# Altium schematic sheet STM32 MCU.SchDoc: C-F-U-Bridge
size A3; ApprovedBy: Luca Schenetti; CheckedBy: Luca Schenetti; Author: Luca Schenetti; DrawnBy: Luca Schenetti; Engineer: Luca Schenetti; Revision: A; SheetNumber: 7; SheetTotal: 7
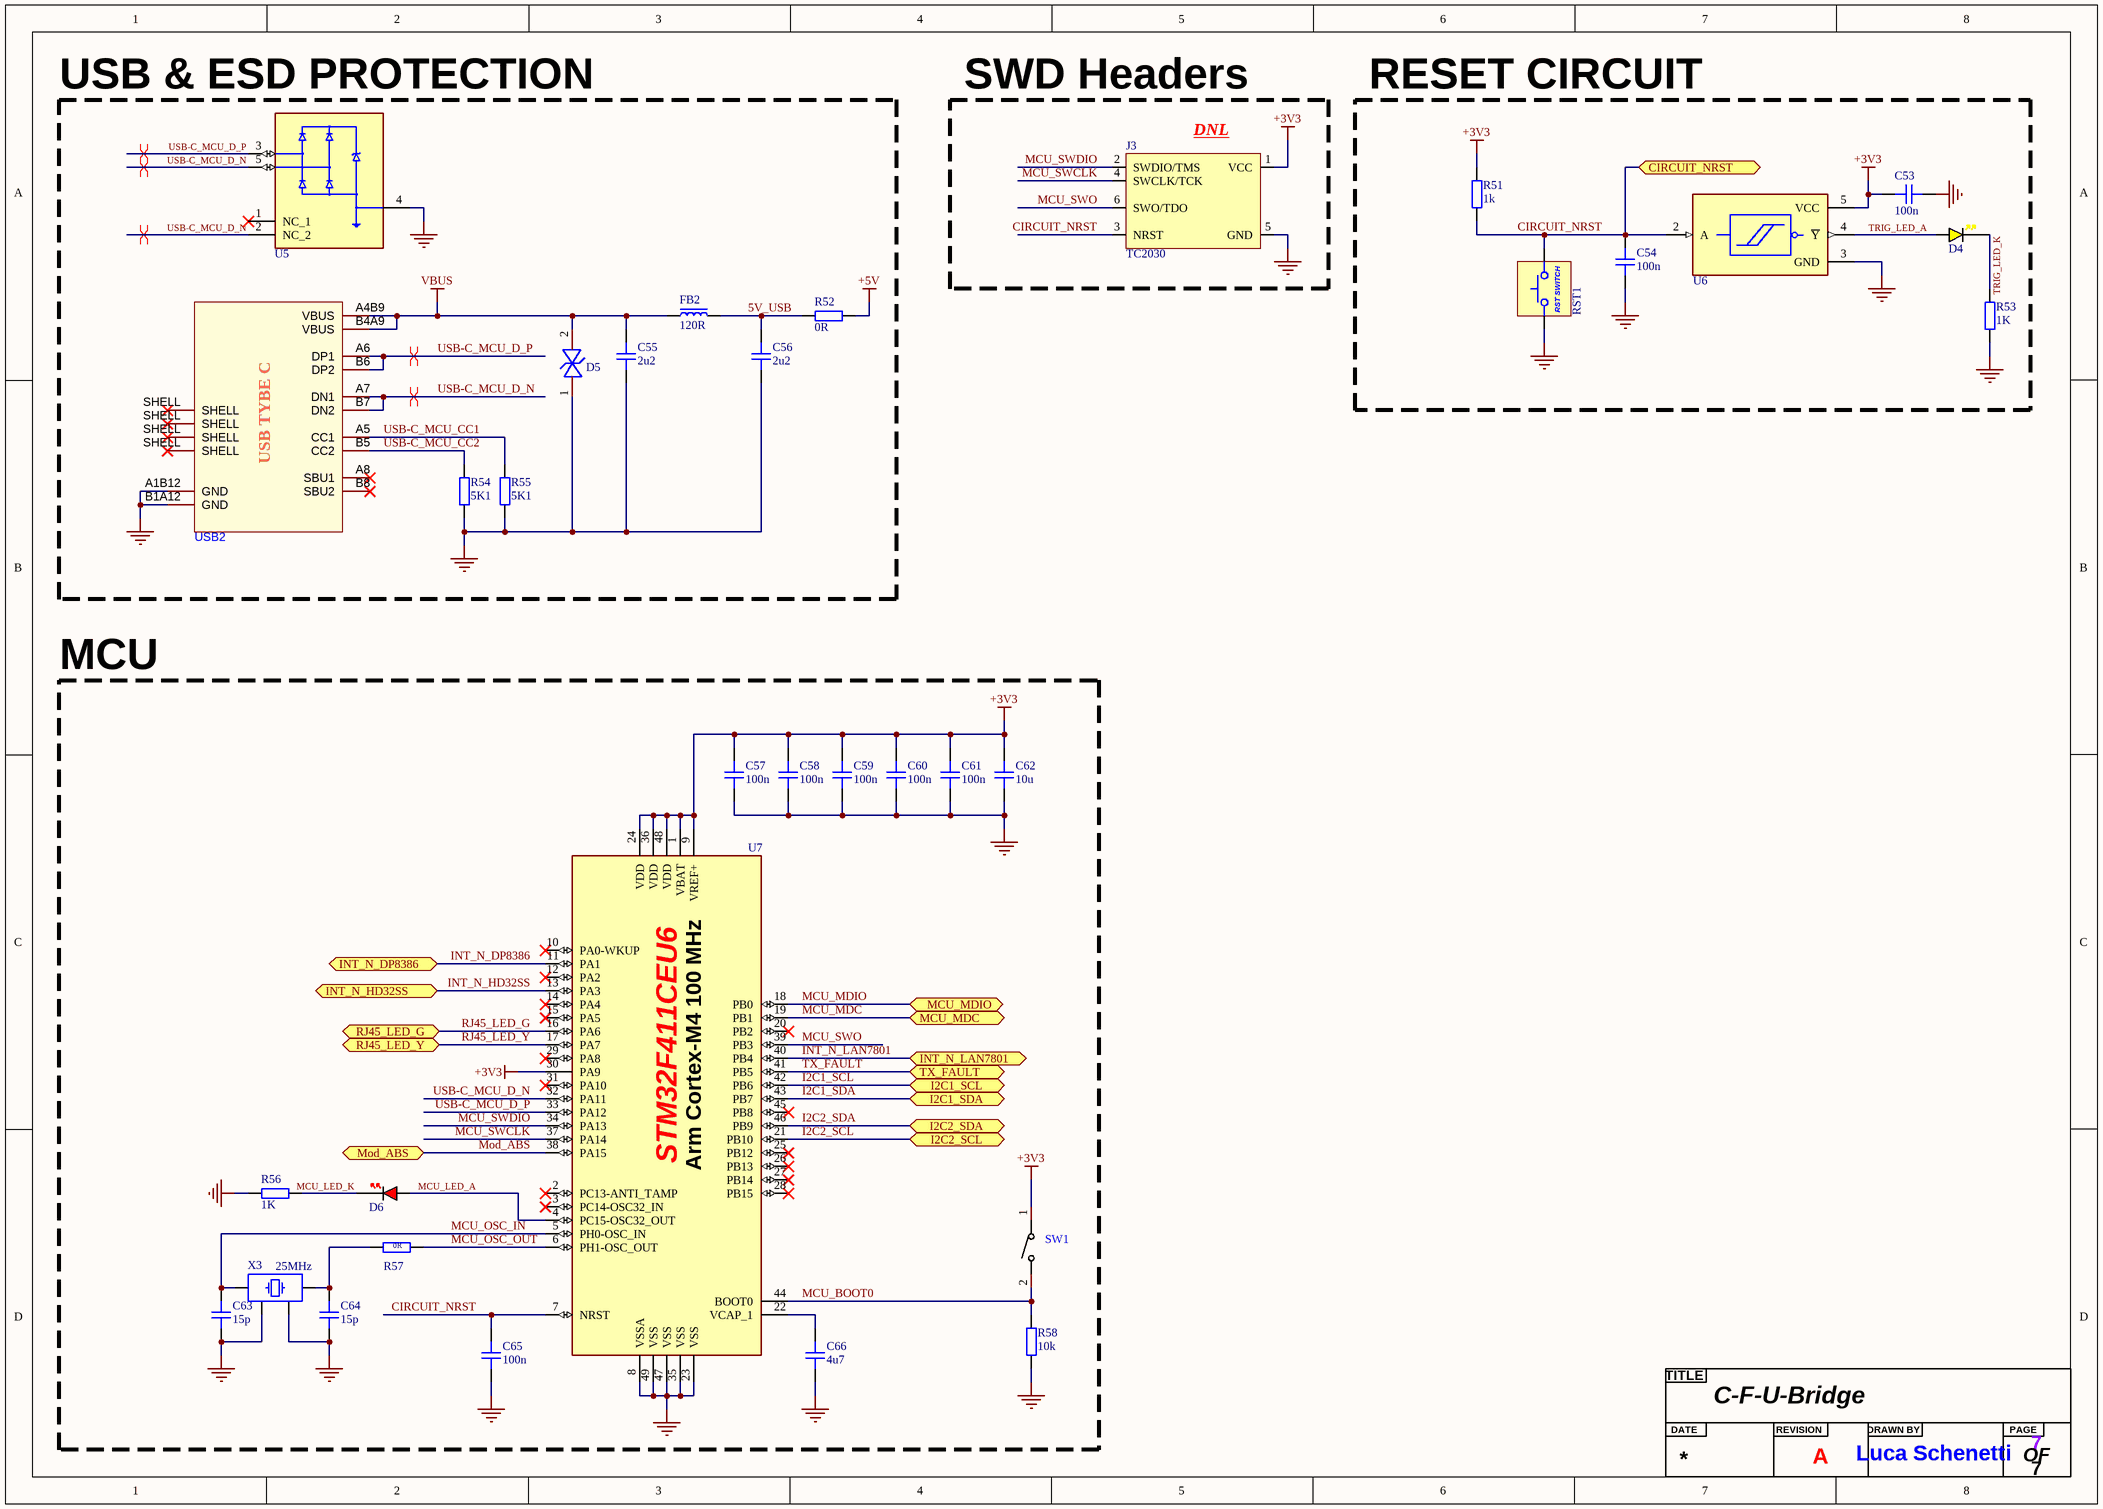
[diagram p0: STM32 MCU.SchDoc]

## Parts
?  Title  (value not drawn)  (graphical)
C53  100n  [CAP_0402]
C54  100n  [CAP_0402]
C55  2u2  [CAP_0603]
C56  2u2  [CAP_0603]
C57  100n  [CAP_0603]
C58  100n  [CAP_0603]
C59  100n  [CAP_0603]
C60  100n  [CAP_0603]
C61  100n  [CAP_0603]
C62  10u  [CAP_0603]
C63  15p  [CAP_0402]
C64  15p  [CAP_0402]
C65  100n  [CAP_0603]
C66  4u7  [CAP_0603]
D4  YELLOW  [LED_0603_YELLOW]  (value not drawn)
D5  ESD Protection TVS 6.0V  [SMF6.0CA]  (value not drawn)
D6  RED  [LED_0603_RED]  (value not drawn)
FB2  120R  [FB_0603]
J3  TC2030  [TC2030-FP]  (no BOM)
R51  1k  [RES_0402]
R52  0R  [RES_0603]
R53  1K  [RES_0402]
R54  5K1  [RES_0603]
R55  5K1  [RES_0603]
R56  1K  [RES_0402]
R57  0R  [RES_0402]
R58  10k  [RES_0603]
RST1  RST_SWITCH_STM32  [RST_SWITCH]  (value not drawn)
SW1  TS-1088-AR02016  [TS-1088-AR02016]  (value not drawn)
U5  TVS USB 2.0 ±25-kV  [TPD2E2U06DRLR]  (value not drawn)
U6  Schmitt Trigger 1.65V~5.5V  [74LVC1G14GW,125]  (value not drawn)
U7  ARM® Cortex®-M4 STM32F4  [STM32F411CEU6]  (value not drawn)
USB2  USB-C CONNECTOR  [USB-3.1-SMD_U262-161N-4BVC11]  (value not drawn)
X3  25MHz  [XTAL_3225]

## Blocks framed on the sheet
USB & ESD PROTECTION: C55 C56 D5 FB2 R52 R54 R55 U5 USB2
SWD Headers: J3
RESET CIRCUIT: C53 C54 D4 R51 R53 RST1 U6
MCU: C57-C66 D6 R56-R58 SW1 U7 X3

## Ports
CIRCUIT_NRST (bidir, see PHY SFC[2C], RGMII USB[3D]), I2C1_SCL (bidir, see PHY SFC CONN[4B]), I2C1_SDA (bidir, see PHY SFC CONN[4B]), I2C2_SCL (bidir, see USB RGMII CONN[1B]), I2C2_SDA (bidir, see USB RGMII CONN[1B]), INT_N_DP8386 (bidir, see PHY SFC[2B]), INT_N_HD32SS (bidir, see USB RGMII CONN[2B]), INT_N_LAN7801 (bidir, see RGMII USB[6C]), MCU_MDC (bidir, see PHY SFC[2B]), MCU_MDIO (bidir, see PHY SFC[2B]), Mod_ABS (bidir, see PHY SFC CONN[4B]), RJ45_LED_G (bidir, see PHY SFC CONN[4C]), RJ45_LED_Y (bidir, see PHY SFC CONN[4C]), TX_FAULT (bidir, see PHY SFC CONN[4A])

## Nets
+3V3: C53.2 C57.2 C58.2 C59.2 C60.2 C61.2 C62.2 J3.1(VCC) R51.2 SW1.1 U6.5(VCC) U7.1(VBAT) U7.9(VREF+) U7.24(VDD) U7.30(PA9) U7.36(VDD) U7.48(VDD)
+5V: R52.2
GND: C53.1 C54.1 C55.1 C56.1 C57.1 C58.1 C59.1 C60.1 C61.1 C62.1 C63.1 C64.1 C65.1 C66.1 D5.1(C) J3.5(GND) R53.1 R54.1 R55.1 R56.1 R58.1 RST1.1 U5.4(GND) U6.3(GND) U7.8(VSSA) U7.23(VSS) U7.35(VSS) U7.47(VSS) U7.49(VSS) USB2.A1B12(GND) USB2.B1A12(GND) X3.2 X3.4
VBUS: C55.2 D5.2(A) FB2.1 USB2.A4B9(VBUS) USB2.B4A9(VBUS)
5V_USB: C56.2 FB2.2 R52.1
CIRCUIT_NRST: C54.2 C65.2 J3.3(NRST) R51.1 RST1.2 U6.2(A) U7.7(NRST) ; port CIRCUIT_NRST
I2C1_SCL: U7.42(PB6) ; port I2C1_SCL
I2C1_SDA: U7.43(PB7) ; port I2C1_SDA
I2C2_SCL: U7.21(PB10) ; port I2C2_SCL
I2C2_SDA: U7.46(PB9) ; port I2C2_SDA
INT_N_DP8386: U7.11(PA1) ; port INT_N_DP8386
INT_N_HD32SS: U7.13(PA3) ; port INT_N_HD32SS
INT_N_LAN7801: U7.40(PB4) ; port INT_N_LAN7801
MCU_BOOT0: R58.2 SW1.2 U7.44(BOOT0)
MCU_LED_A: D6.A U7.4(PC15-OSC32_OUT)
MCU_LED_K: D6.K R56.2
MCU_MDC: U7.19(PB1) ; port MCU_MDC
MCU_MDIO: U7.18(PB0) ; port MCU_MDIO
MCU_OSC_IN: C63.2 U7.5(PH0-OSC_IN) X3.3
MCU_OSC_OUT: R57.2 U7.6(PH1-OSC_OUT)
MCU_SWCLK: J3.4(SWCLK/TCK) U7.37(PA14)
MCU_SWDIO: J3.2(SWDIO/TMS) U7.34(PA13)
MCU_SWO: J3.6(SWO/TDO) U7.39(PB3)
Mod_ABS: U7.38(PA15) ; port Mod_ABS
RJ45_LED_G: U7.16(PA6) ; port RJ45_LED_G
RJ45_LED_Y: U7.17(PA7) ; port RJ45_LED_Y
TRIG_LED_A: D4.A U6.4(~{Y})
TRIG_LED_K: D4.K R53.2
TX_FAULT: U7.41(PB5) ; port TX_FAULT
USB-C_MCU_CC1: R55.2 USB2.A5(CC1)
USB-C_MCU_CC2: R54.2 USB2.B5(CC2)
USB-C_MCU_D_N: U5.2(NC_2) U5.5(IO2) U7.32(PA11) USB2.A7(DN1) USB2.B7(DN2)
USB-C_MCU_D_P: U5.3(IO1) U7.33(PA12) USB2.A6(DP1) USB2.B6(DP2)
NetC64_2: C64.2 R57.1 X3.1
NetC66_2: C66.2 U7.22(VCAP_1)

Not connected (* = marked no-connect by the designer): U5 1(NC_1)*; U7 2(PC13-ANTI_TAMP)* 3(PC14-OSC32_IN)* 10(PA0-WKUP)* 12(PA2)* 14(PA4)* 15(PA5)* 20(PB2)* 25(PB12)* 26(PB13)* 27(PB14)* 28(PB15)* 29(PA8)* 31(PA10)* 45(PB8)*; USB2 A8(SBU1)* B8(SBU2)* SHELL*

## Layout directives
differential pair; differential pair class DIFF_USB_90Ω: USB-C_MCU_D_N, USB-C_MCU_D_P

## Notes on the sheet
- (near J3) DNL
- (in symbol RST_SWITCH) RST SWITCH
- (in symbol STM32F411CEU6) Arm Cortex-M4 100 MHz
- (in symbol Title) TITLE; DATE; REVISION; DRAWN BY; PAGE; OF
- (in symbol U262-161N-4BVC11) USB TYBE C

## Library data of the parts
C53 C54 = CAP_0402: Capacitor SMD 0402 [C1525]; Manufacturer: *; Manufacturer Part Number: *; Distributor Link: *; LCSC: *; Rating: *; Dielectric: *
C55 C56 = CAP_0603: Capacitor SMD 0603 [C23630]; Manufacturer: *; Manufacturer Part Number: *; Distributor Link: *; LCSC: *; Rating: *; Dielectric: *
C57-C61 C65 = CAP_0603: Capacitor SMD 0603 [C14663]; Manufacturer: *; Manufacturer Part Number: *; Distributor Link: *; LCSC: *; Rating: *; Dielectric: *
C62 = CAP_0603: Capacitor SMD 0603 [C96446]; Manufacturer: *; Manufacturer Part Number: *; Distributor Link: *; LCSC: *; Rating: *; Dielectric: *
C63 C64 = CAP_0402: Capacitor SMD 0402 [C1548]; Manufacturer: *; Manufacturer Part Number: *; Distributor Link: *; LCSC: *; Rating: *; Dielectric: *
C66 = CAP_0603: Capacitor SMD 0603 [C19666]; Manufacturer: *; Manufacturer Part Number: *; Distributor Link: *; LCSC: *; Rating: *; Dielectric: *
D4 = LED_0603_YELLOW: LED 0603 YELLOW SMD[C72038]
D5 = SMF6.0CA: [C2990473]
D6 = LED_0603_RED: LED 0603 RED SMD[C2926776]
FB2 = FB_0603: Ferrite Bead SMD 0603[C76892]; Manufacturer: *; Manufacturer Part Number: *; Distributor Link: *; LCSC: *
J3 = TC2030: Tag-Connect No-Solder SWD Debug Connector DO NOT PLACE; Manufacturer: Tag-Connect; Manufacturer Part Number: TC2030
R51 R53 R56 = RES_0402: Resistor SMD 0402 [C11702]; Manufacturer: *; Manufacturer Part Number: *; Distributor Link: *; LCSC: *
R52 = RES_0603: [C21189]; Manufacturer: *; Manufacturer Part Number: *; Distributor Link: *; LCSC: *
R54 R55 = RES_0603: [C23186]; Manufacturer: *; Manufacturer Part Number: *; Distributor Link: *; LCSC: *
R57 = RES_0402: Resistor SMD 0402 [C17168]; Manufacturer: *; Manufacturer Part Number: *; Distributor Link: *; LCSC: *
R58 = RES_0603: Resistor SMD 0603[C25804]; Manufacturer: *; Manufacturer Part Number: *; Distributor Link: *; LCSC: *
RST1 = RST_SWITCH: [C720477]
SW1 = TS-1088-AR02016: [C720477]; Manufacturer: XUNPU(讯普); Add into BOM: yes; Circuit: SPST; Actuator Style: Round Button; Operating Force: 160gf; Switch Length: 4mm; Switch Width: 3mm; Switch Height: 2mm; Strike Gundam: 不带; Contact Current: 50mA; Voltage Rating (DC): 12V; Insulation Resistance: 100MΩ; Actuator/Cap Color: Black; Pin Style: SMDSplicing; Mechanical Life: 10万次; Symbol: TS-1088-AR02016; Device: TS-1088-AR02016; Supplier: LCSC; Supplier Part: C720477; Manufacturer Part: TS-1088-AR02016; JLCPCB Part Class: Extended Part; LCSC Part Name: 4*3*2mm 立贴 轻触开关; Supplier Footprint: SMD; Datasheet: https://atta.szlcsc.com/upload/public/pdf/source/20200810/C720475_60D09DD6C54279ADDB2DC25100F1CC11.pdf; Convert to PCB: yes; Mounting Style: Brick nogging; Operating Temperature: -30℃~+80℃
U5 = TPD2E2U06DRLR: [C1972959]
U6 = 74LVC1G14GW,125: [C265125]
U7 = STM32F411CEU6: [C60420]
USB2 = U262-161N-4BVC11: [C319148]; Manufacturer: XKB Connectivity(中国星坤); Symbol: U262-16XN-4BVC11; Add into BOM: yes; Connector Type: Type-C; Gender: Female; Number of Ports: 1; Number of Contacts: 16P; Current Rating - Power (Max): 3A; Soldering Temperature(Max): 260℃; Device: U262-161N-4BVC11; LCSC Part Name: Type-C 母 卧贴; Supplier Part: C319148; Manufacturer Part: U262-161N-4BVC11; Supplier Footprint: SMD; JLCPCB Part Class: Extended Part; Datasheet: https://atta.szlcsc.com/upload/public/pdf/source/20211015/B478CBA0F1623DA36A6CC6918C49C838.pdf; Supplier: LCSC; Convert to PCB: yes; Standard: USB 3.1; Mounting Style: 卧贴; Contact Material: Copper Alloy; Contact Plating: Gold; Operating Temperature Range: -40℃~+85℃
X3 = TSX-3225_24.0000MF15X-AC: Crystal SMD 24MHz 10PPM 7pF 3225 [C9006]; Manufacturer: Epson; Manufacturer Part Number: TSX-3225 24.0000MF15X-AC